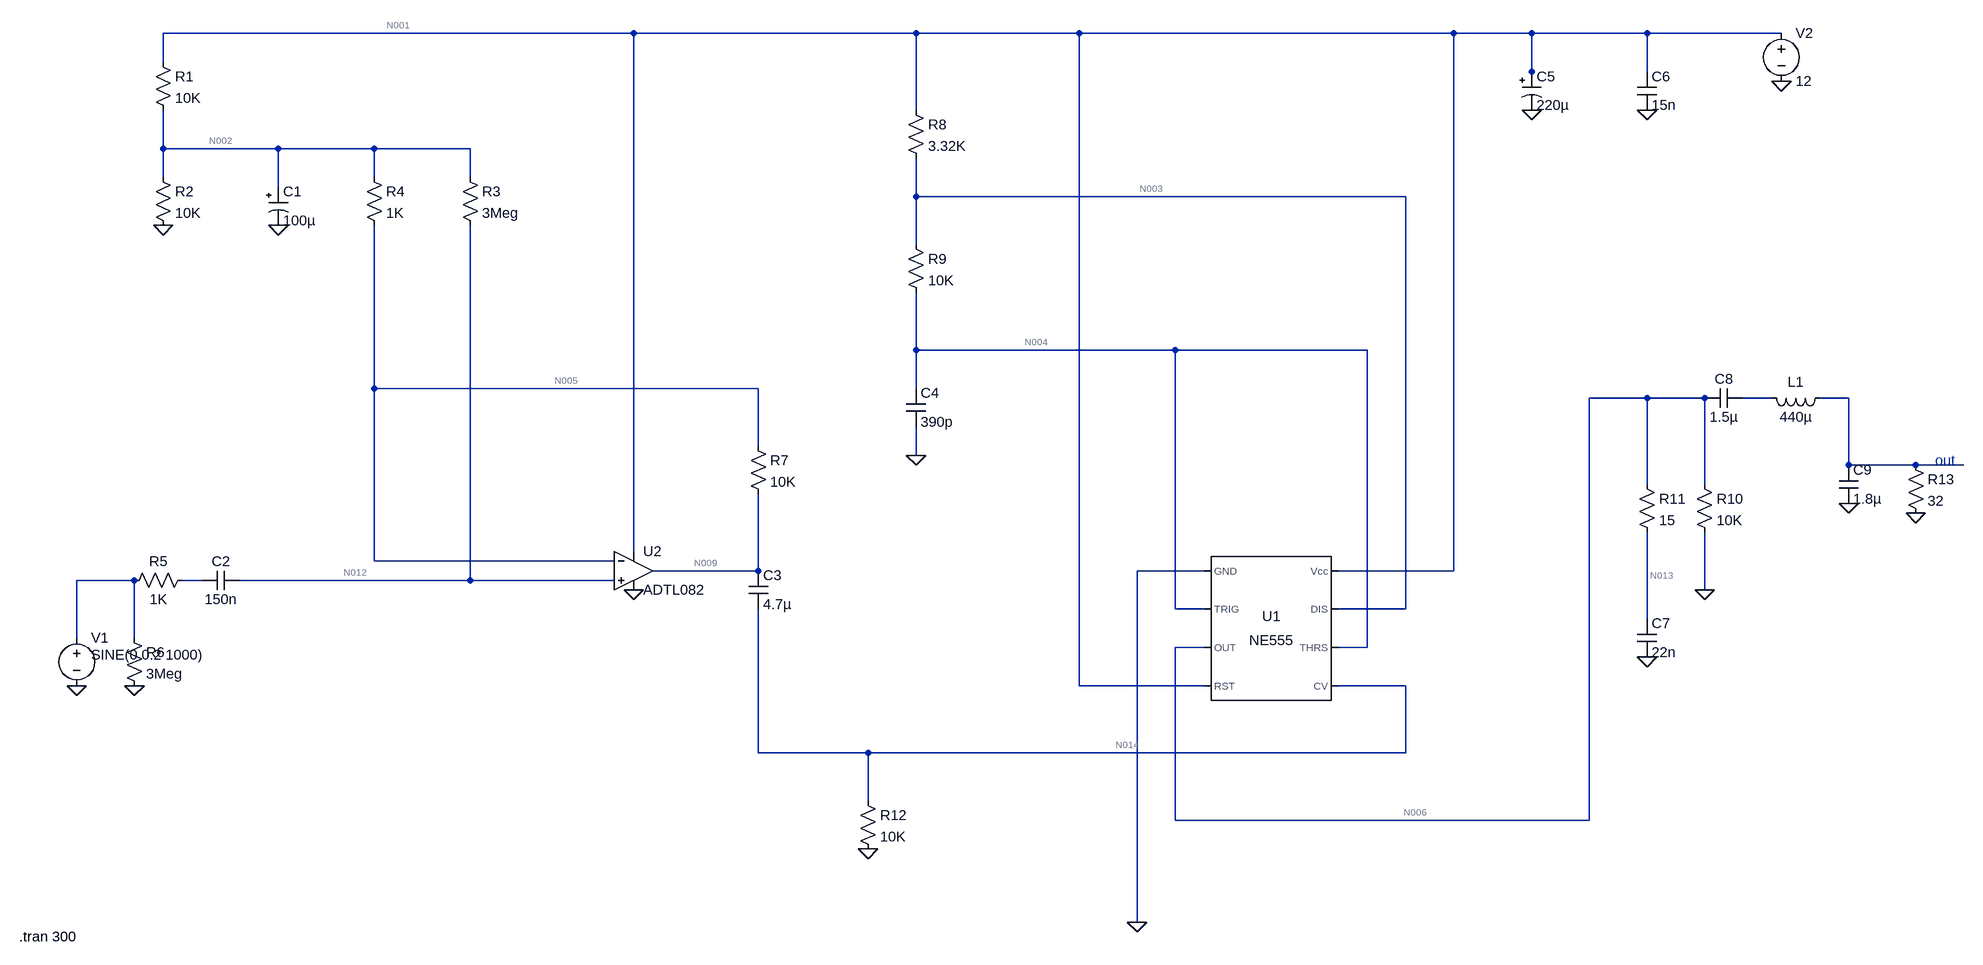
[diagram p0: schematic amplifire D_3.asc]
amplifire D_3.asc, the LTspice schematic file:
Version 4
SHEET 1 2212 792
WIRE -896 -800 -1680 -800
WIRE -352 -800 -896 -800
WIRE -48 -800 -352 -800
WIRE 576 -800 -48 -800
WIRE 816 -800 576 -800
WIRE 1008 -800 816 -800
WIRE 1232 -800 1008 -800
WIRE -1680 -752 -1680 -800
WIRE 816 -736 816 -800
WIRE 1008 -736 1008 -800
WIRE 816 -720 816 -736
WIRE -352 -672 -352 -800
WIRE -1680 -608 -1680 -672
WIRE -1488 -608 -1680 -608
WIRE -1328 -608 -1488 -608
WIRE -1168 -608 -1328 -608
WIRE -1680 -560 -1680 -608
WIRE -1328 -560 -1328 -608
WIRE -1168 -560 -1168 -608
WIRE -1488 -544 -1488 -608
WIRE -352 -528 -352 -592
WIRE 496 -528 -352 -528
WIRE -352 -448 -352 -528
WIRE -352 -272 -352 -368
WIRE 112 -272 -352 -272
WIRE 432 -272 112 -272
WIRE -1328 -208 -1328 -480
WIRE -688 -208 -1328 -208
WIRE -352 -208 -352 -272
WIRE 1008 -192 912 -192
WIRE 1104 -192 1008 -192
WIRE 1216 -192 1168 -192
WIRE 1344 -192 1296 -192
WIRE -688 -112 -688 -208
WIRE -352 -96 -352 -144
WIRE 1344 -80 1344 -192
WIRE 1456 -80 1344 -80
WIRE 1536 -80 1456 -80
WIRE 1344 -64 1344 -80
WIRE 1008 -48 1008 -192
WIRE 1104 -48 1104 -192
WIRE -896 64 -896 -800
WIRE -1328 80 -1328 -208
WIRE -928 80 -1328 80
WIRE -688 96 -688 -32
WIRE -688 96 -864 96
WIRE 160 96 48 96
WIRE 576 96 576 -800
WIRE 576 96 384 96
WIRE -1728 112 -1824 112
WIRE -1616 112 -1648 112
WIRE -1168 112 -1168 -480
WIRE -1168 112 -1552 112
WIRE -928 112 -1168 112
WIRE 1104 128 1104 32
WIRE 112 160 112 -272
WIRE 160 160 112 160
WIRE 496 160 496 -528
WIRE 496 160 384 160
WIRE 1008 176 1008 32
WIRE -1824 208 -1824 112
WIRE -1728 208 -1728 112
WIRE 160 224 112 224
WIRE 432 224 432 -272
WIRE 432 224 384 224
WIRE -48 288 -48 -800
WIRE 160 288 -48 288
WIRE 496 288 384 288
WIRE -688 400 -688 160
WIRE -432 400 -688 400
WIRE 496 400 496 288
WIRE 496 400 -432 400
WIRE -432 480 -432 400
WIRE 112 512 112 224
WIRE 912 512 912 -192
WIRE 912 512 112 512
WIRE 48 752 48 96
FLAG -1680 -480 0
FLAG -1488 -480 0
FLAG -896 128 0
FLAG -1728 288 0
FLAG 48 752 0
FLAG -352 -96 0
FLAG 1104 128 0
FLAG 1232 -720 0
FLAG -1824 288 0
FLAG 816 -672 0
FLAG 1008 -672 0
FLAG 1008 240 0
FLAG -432 560 0
FLAG 1344 -16 0
FLAG 1456 0 0
SYMBOL Misc\\NE555 272 192 R0
SYMATTR InstName U1
SYMBOL Opamps\\ADTL082 -896 32 R0
SYMATTR InstName U2
SYMBOL res -1696 -768 R0
SYMATTR InstName R1
SYMATTR Value 10K
SYMATTR SpiceLine tol=1 pwr=0.1
SYMBOL res -1696 -576 R0
SYMATTR InstName R2
SYMATTR Value 10K
SYMATTR SpiceLine tol=1 pwr=0.1
SYMBOL polcap -1504 -544 R0
WINDOW 3 24 56 Left 2
SYMATTR Value 100µ
SYMATTR InstName C1
SYMATTR Description Capacitor
SYMATTR Type cap
SYMATTR SpiceLine V=16 Irms=0 Rser=0.9 Lser=0 mfg="AVX" pn="TAJE107K016" type="Tantalum"
SYMBOL res -1184 -576 R0
SYMATTR InstName R3
SYMATTR Value 3Meg
SYMATTR SpiceLine tol=1 pwr=0.1
SYMBOL res -1344 -576 R0
SYMATTR InstName R4
SYMATTR Value 1K
SYMATTR SpiceLine tol=1 pwr=0.1
SYMBOL cap -1552 96 R90
WINDOW 0 0 32 VBottom 2
WINDOW 3 32 32 VTop 2
SYMATTR InstName C2
SYMATTR Value 150n
SYMATTR SpiceLine V=50 Irms=1.11 Rser=0.0283161 Lser=0 mfg="KEMET" pn="C0603C154K5RAC" type="X7R"
SYMBOL res -1632 96 R90
WINDOW 0 0 56 VBottom 2
WINDOW 3 32 56 VTop 2
SYMATTR InstName R5
SYMATTR Value 1K
SYMATTR SpiceLine tol=1 pwr=0.1
SYMBOL res -1744 192 R0
SYMATTR InstName R6
SYMATTR Value 3Meg
SYMATTR SpiceLine tol=1 pwr=0.1
SYMBOL res -704 -128 R0
SYMATTR InstName R7
SYMATTR Value 10K
SYMATTR SpiceLine tol=1 pwr=0.1
SYMBOL cap -704 96 R0
SYMATTR Value 4.7µ
SYMATTR InstName C3
SYMATTR SpiceLine V=16 Irms=9.88 Rser=0.00384339 Lser=0 mfg="KEMET" pn="C0805C475K4PAC" type="X5R"
SYMBOL res -368 -688 R0
SYMATTR InstName R8
SYMATTR Value 3.32K
SYMATTR SpiceLine tol=1 pwr=0.1
SYMBOL res -368 -464 R0
SYMATTR InstName R9
SYMATTR Value 10K
SYMATTR SpiceLine tol=1 pwr=0.1
SYMBOL cap -368 -208 R0
SYMATTR InstName C4
SYMATTR Value 390p
SYMATTR SpiceLine V=16 Irms=25.7m Rser=8.19371 Lser=0 mfg="KEMET" pn="C0402C391K4RAC" type="X7R"
SYMBOL res 1088 -64 R0
SYMATTR InstName R10
SYMATTR Value 10K
SYMATTR SpiceLine tol=1 pwr=0.1
SYMBOL voltage -1824 192 R0
WINDOW 3 24 44 Left 2
WINDOW 123 0 0 Left 2
WINDOW 39 0 0 Left 2
SYMATTR Value SINE(0 0.2 1000)
SYMATTR InstName V1
SYMBOL voltage 1232 -816 R0
WINDOW 123 0 0 Left 2
WINDOW 39 0 0 Left 2
SYMATTR InstName V2
SYMATTR Value 12
SYMBOL polcap 800 -736 R0
WINDOW 3 24 56 Left 2
SYMATTR Value 220µ
SYMATTR InstName C5
SYMATTR Description Capacitor
SYMATTR Type cap
SYMATTR SpiceLine V=25 Irms=555m Rser=0.13 Lser=0 mfg="United Chemi-Con" pn="LXF25VB221M8X15LL" type="Al electrolytic"
SYMBOL cap 992 -736 R0
SYMATTR InstName C6
SYMATTR Value 15n
SYMATTR SpiceLine V=25 Irms=364m Rser=0.268918 Lser=0 mfg="KEMET" pn="C1206C153K3RAC" type="X7R"
SYMBOL res 992 -64 R0
SYMATTR InstName R11
SYMATTR Value 15
SYMATTR SpiceLine tol=1 pwr=0.1
SYMBOL cap 992 176 R0
SYMATTR InstName C7
SYMATTR Value 22n
SYMATTR SpiceLine V=50 Irms=714m Rser=0.199778 Lser=0 mfg="KEMET" pn="C1210C223K5RAC" type="X7R"
SYMBOL res -448 464 R0
SYMATTR InstName R12
SYMATTR Value 10K
SYMATTR SpiceLine tol=1 pwr=0.1
SYMBOL cap 1168 -208 R90
WINDOW 0 0 32 VBottom 2
WINDOW 3 32 32 VTop 2
SYMATTR InstName C8
SYMATTR Value 1.5µ
SYMATTR SpiceLine V=25 Irms=6.58 Rser=0.0116219 Lser=0 mfg="KEMET" pn="C0603C155K3PAC" type="X5R"
SYMBOL ind 1312 -208 R90
WINDOW 0 5 56 VBottom 2
WINDOW 3 32 56 VTop 2
SYMATTR InstName L1
SYMATTR Value 440µ
SYMATTR SpiceLine Ipk=1.15 Rser=0.153 Rpar=17537 Cpar=4.1p
SYMBOL cap 1328 -80 R0
SYMATTR InstName C9
SYMATTR Value 1.8µ
SYMATTR SpiceLine V=50 Irms=5.34 Rser=0.0241499 Lser=0 mfg="KEMET" pn="C2225C185K5RAC" type="X7R"
SYMBOL res 1440 -96 R0
SYMATTR InstName R13
SYMATTR Value 32
SYMATTR SpiceLine tol=1 pwr=0.1
TEXT -1920 776 Left 2 !.tran 300
TEXT 1488 -88 Left 2 ;out

The netlist it stands for:
* amplifire D_3.asc
XU1 0 N004 N006 N001 N014 N004 N003 N001 NE555  ; pins GND TRIG OUT RST CV THRS DIS Vcc
XU2 N012 N005 N001 0 N009 ADTL082  ; pins In+ In- V+ V- OUT
R1 N001 N002 10K tol=1 pwr=0.1
R2 N002 0 10K tol=1 pwr=0.1
C1 N002 0 100µ V=16 Irms=0 Rser=0.9 Lser=0 mfg="AVX" pn="TAJE107K016" type="Tantalum"
R3 N002 N012 3Meg tol=1 pwr=0.1
R4 N002 N005 1K tol=1 pwr=0.1
C2 N012 N011 150n V=50 Irms=1.11 Rser=0.0283161 Lser=0 mfg="KEMET" pn="C0603C154K5RAC" type="X7R"
R5 N011 N010 1K tol=1 pwr=0.1
R6 N010 0 3Meg tol=1 pwr=0.1
R7 N005 N009 10K tol=1 pwr=0.1
C3 N009 N014 4.7µ V=16 Irms=9.88 Rser=0.00384339 Lser=0 mfg="KEMET" pn="C0805C475K4PAC" type="X5R"
R8 N001 N003 3.32K tol=1 pwr=0.1
R9 N003 N004 10K tol=1 pwr=0.1
C4 N004 0 390p V=16 Irms=25.7m Rser=8.19371 Lser=0 mfg="KEMET" pn="C0402C391K4RAC" type="X7R"
R10 N006 0 10K tol=1 pwr=0.1
V1 N010 0 SINE(0 0.2 1000)
V2 N001 0 12
C5 N001 0 220µ V=25 Irms=555m Rser=0.13 Lser=0 mfg="United Chemi-Con" pn="LXF25VB221M8X15LL" type="Al electrolytic"
C6 N001 0 15n V=25 Irms=364m Rser=0.268918 Lser=0 mfg="KEMET" pn="C1206C153K3RAC" type="X7R"
R11 N006 N013 15 tol=1 pwr=0.1
C7 N013 0 22n V=50 Irms=714m Rser=0.199778 Lser=0 mfg="KEMET" pn="C1210C223K5RAC" type="X7R"
R12 N014 0 10K tol=1 pwr=0.1
C8 N007 N006 1.5µ V=25 Irms=6.58 Rser=0.0116219 Lser=0 mfg="KEMET" pn="C0603C155K3PAC" type="X5R"
L1 N008 N007 440µ Ipk=1.15 Rser=0.153 Rpar=17537 Cpar=4.1p
C9 N008 0 1.8µ V=50 Irms=5.34 Rser=0.0241499 Lser=0 mfg="KEMET" pn="C2225C185K5RAC" type="X7R"
R13 N008 0 32 tol=1 pwr=0.1
.tran 300
* out
.lib NE555.sub
.lib ADI.lib
.backanno
.end

* Results of the author's LTspice run, read from the files saved beside the schematic
* Operating Point, zero values left out:
*   V(n004) = 12 V
*   V(n014) = 6 V
*   V(n001) = 12 V
*   V(n003) = 12 V
*   V(n006) = 11.99 V
*   V(n012) = 6.008 V
*   V(n005) = 6.009 V
*   V(n009) = 6.025 V
*   V(n002) = 6.008 V
*   V(n013) = 11.99 V
*   I(R12) = 600 µA
*   I(R10) = 1.199 mA
*   I(R9) = 24 nA
*   I(R8) = 40.01 nA
*   I(R7) = -1.542 µA
*   I(R4) = -1.542 µA
*   I(R3) = 34.99 pA
*   I(R2) = 600.8 µA
*   I(R1) = 599.2 µA
*   I(V2) = -7.238 mA
*   Ix(u1:1) = -3.681 mA
*   Ix(u1:2) = 12 nA
*   Ix(u1:3) = -1.199 mA
*   Ix(u1:4) = 69.33 µA
*   Ix(u1:5) = -600 µA
*   Ix(u1:6) = 12 nA
*   Ix(u1:7) = 16.01 nA
*   Ix(u1:8) = 5.411 mA
*   Ix(u2:1) = 34.99 pA
*   Ix(u2:2) = 32.99 pA
*   Ix(u2:99) = 1.158 mA
*   Ix(u2:50) = -1.156 mA
*   Ix(u2:30) = -1.542 µA